# EAGLE schematic led-ledshaped (EAGLE 6.5.0)
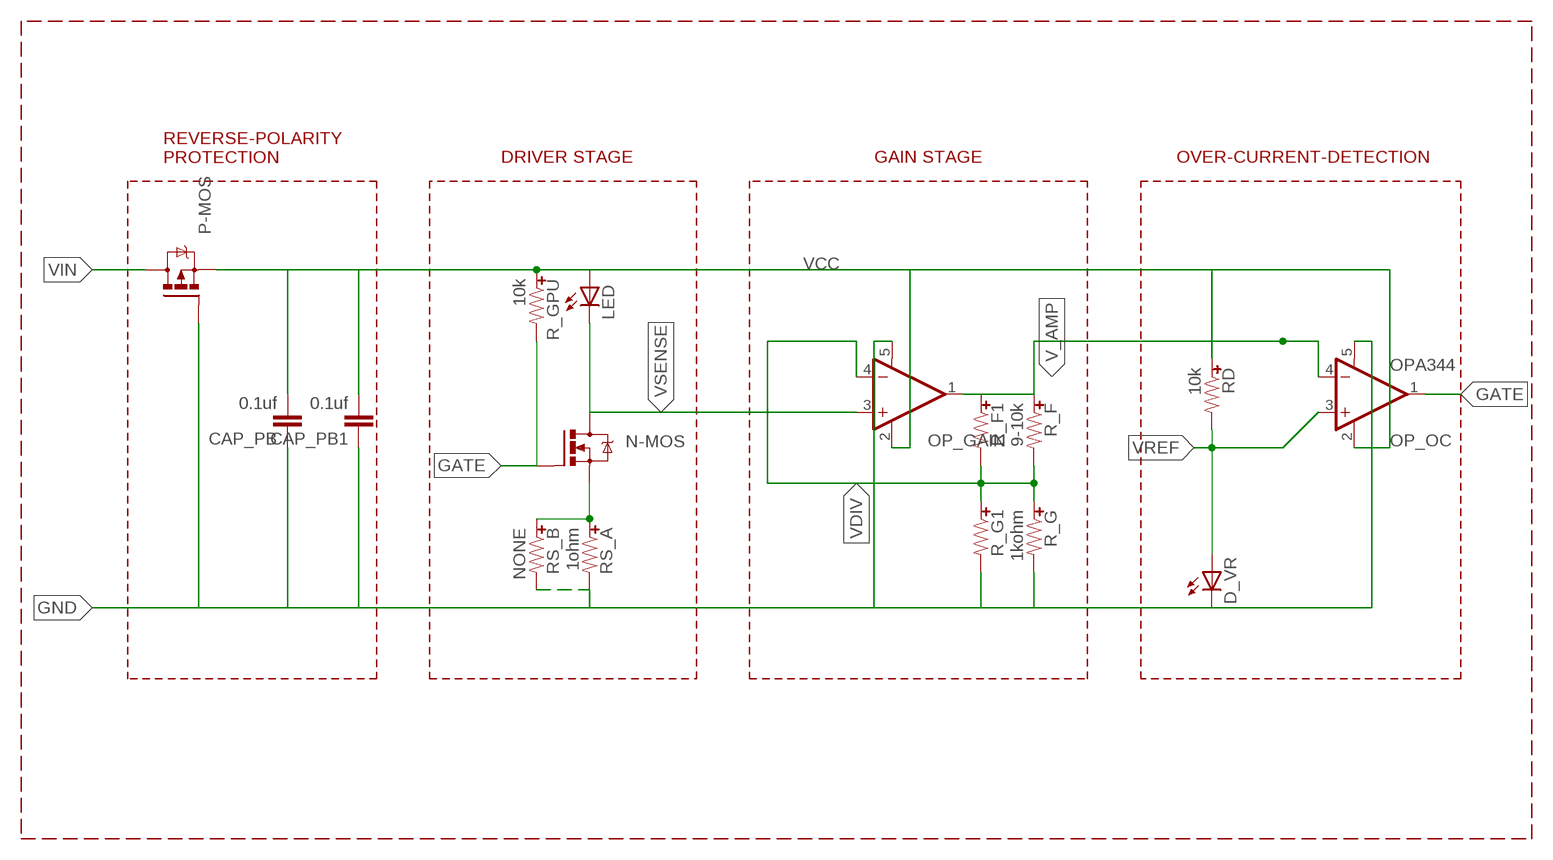
[diagram p0: schematic, sheet 1]

## Parts
CAP_PB  0.1uf  CAPUNIVERSAL  [0402-0603-0805-UNIVERSAL]
CAP_PB1  0.1uf  CAPUNIVERSAL  [0402-0603-0805-UNIVERSAL]
D_VR  LEDUNIVERSAL  [0402-0603-0805-UNIVERSAL]
LED  LEDUNIVERSAL  [0402-0603-0805-UNIVERSAL]
N-MOS  MOSFET-NCHANNELSMD  [SOT23-3]
OP_GAIN  OPA344  [SOT23-5]
OP_OC  OPA344  [SOT23-5]
P-MOS  MOSFET-PCHANNEL  [SOT23-3]
R_F  9-10k  RESISTORUNIVERSAL  [0402-0603-0805-UNIVERSAL]
R_F1  RESISTORUNIVERSAL  [0402-0603-0805-UNIVERSAL]
R_G  1kohm  RESISTORUNIVERSAL  [0402-0603-0805-UNIVERSAL]
R_G1  RESISTORUNIVERSAL  [0402-0603-0805-UNIVERSAL]
R_GPU  10k  RESISTORUNIVERSAL  [0402-0603-0805-UNIVERSAL]
RD  10k  RESISTORUNIVERSAL  [0402-0603-0805-UNIVERSAL]
RS_A  1ohm  RESISTORUNIVERSAL  [0402-0603-0805-UNIVERSAL]
RS_B  NONE  RESISTORUNIVERSAL  [0402-0603-0805-UNIVERSAL]

## Nets
GATE: N-MOS.1(G) OP_OC.1(OUT) R_GPU.-
GND: CAP_PB1.- CAP_PB.- D_VR.-(C) OP_GAIN.5(V+) OP_OC.5(V+) P-MOS.1(G) R_G1.- R_G.- RS_A.- RS_B.-
N$2: N-MOS.2(S) RS_A.+ RS_B.+
V_AMP: OP_GAIN.1(OUT) OP_OC.4(-IN) R_F1.+ R_F.+
VCC: CAP_PB1.+ CAP_PB.+ LED.+(A) OP_GAIN.2(V-) OP_OC.2(V-) P-MOS.2(S) R_GPU.+ RD.+
VDIV: OP_GAIN.4(-IN) R_F1.- R_F.- R_G1.+ R_G.+
VIN: P-MOS.3(D)
VREF: D_VR.+(A) OP_OC.3(+IN) RD.-
VSENSE: LED.-(C) N-MOS.3(D) OP_GAIN.3(+IN)

## Notes on the sheet
- REVERSE-POLARITY
  PROTECTION
- DRIVER STAGE | GAIN STAGE | OVER-CURRENT-DETECTION

## Library data of the parts
CAP_PB CAP_PB1 = tekdemo:CAP: Capacitor Standard 0603 ceramic capacitor, and 0.1" leaded capacitor.
D_VR LED = tekdemo:LED: LEDs Standard schematic elements and footprints for 5mm, 3mm, 1206, and 0603 sized LEDs. 5mm - Spark Fun Electronics SKU : Comp-SBL
N-MOS = tekdemo:MOSFET-NCHANNEL: Generic NMOS footprint
OP_GAIN OP_OC = SparkFun-AnalogIC:OPA344: Single gate rail-to-rail output op-amp. Inputs extend 300mV past rails.
P-MOS = tekdemo:MOSFET-PCHANNEL: Generic PMOSFET; PROD_ID: TRANS-08285
R_F R_F1 R_G R_G1 R_GPU RD RS_A RS_B = tekdemo:RESISTOR: Resistor Basic schematic elements and footprints for 0603, 1206, and PTH resistors.